# Altium project PainRegister.PrjPcb
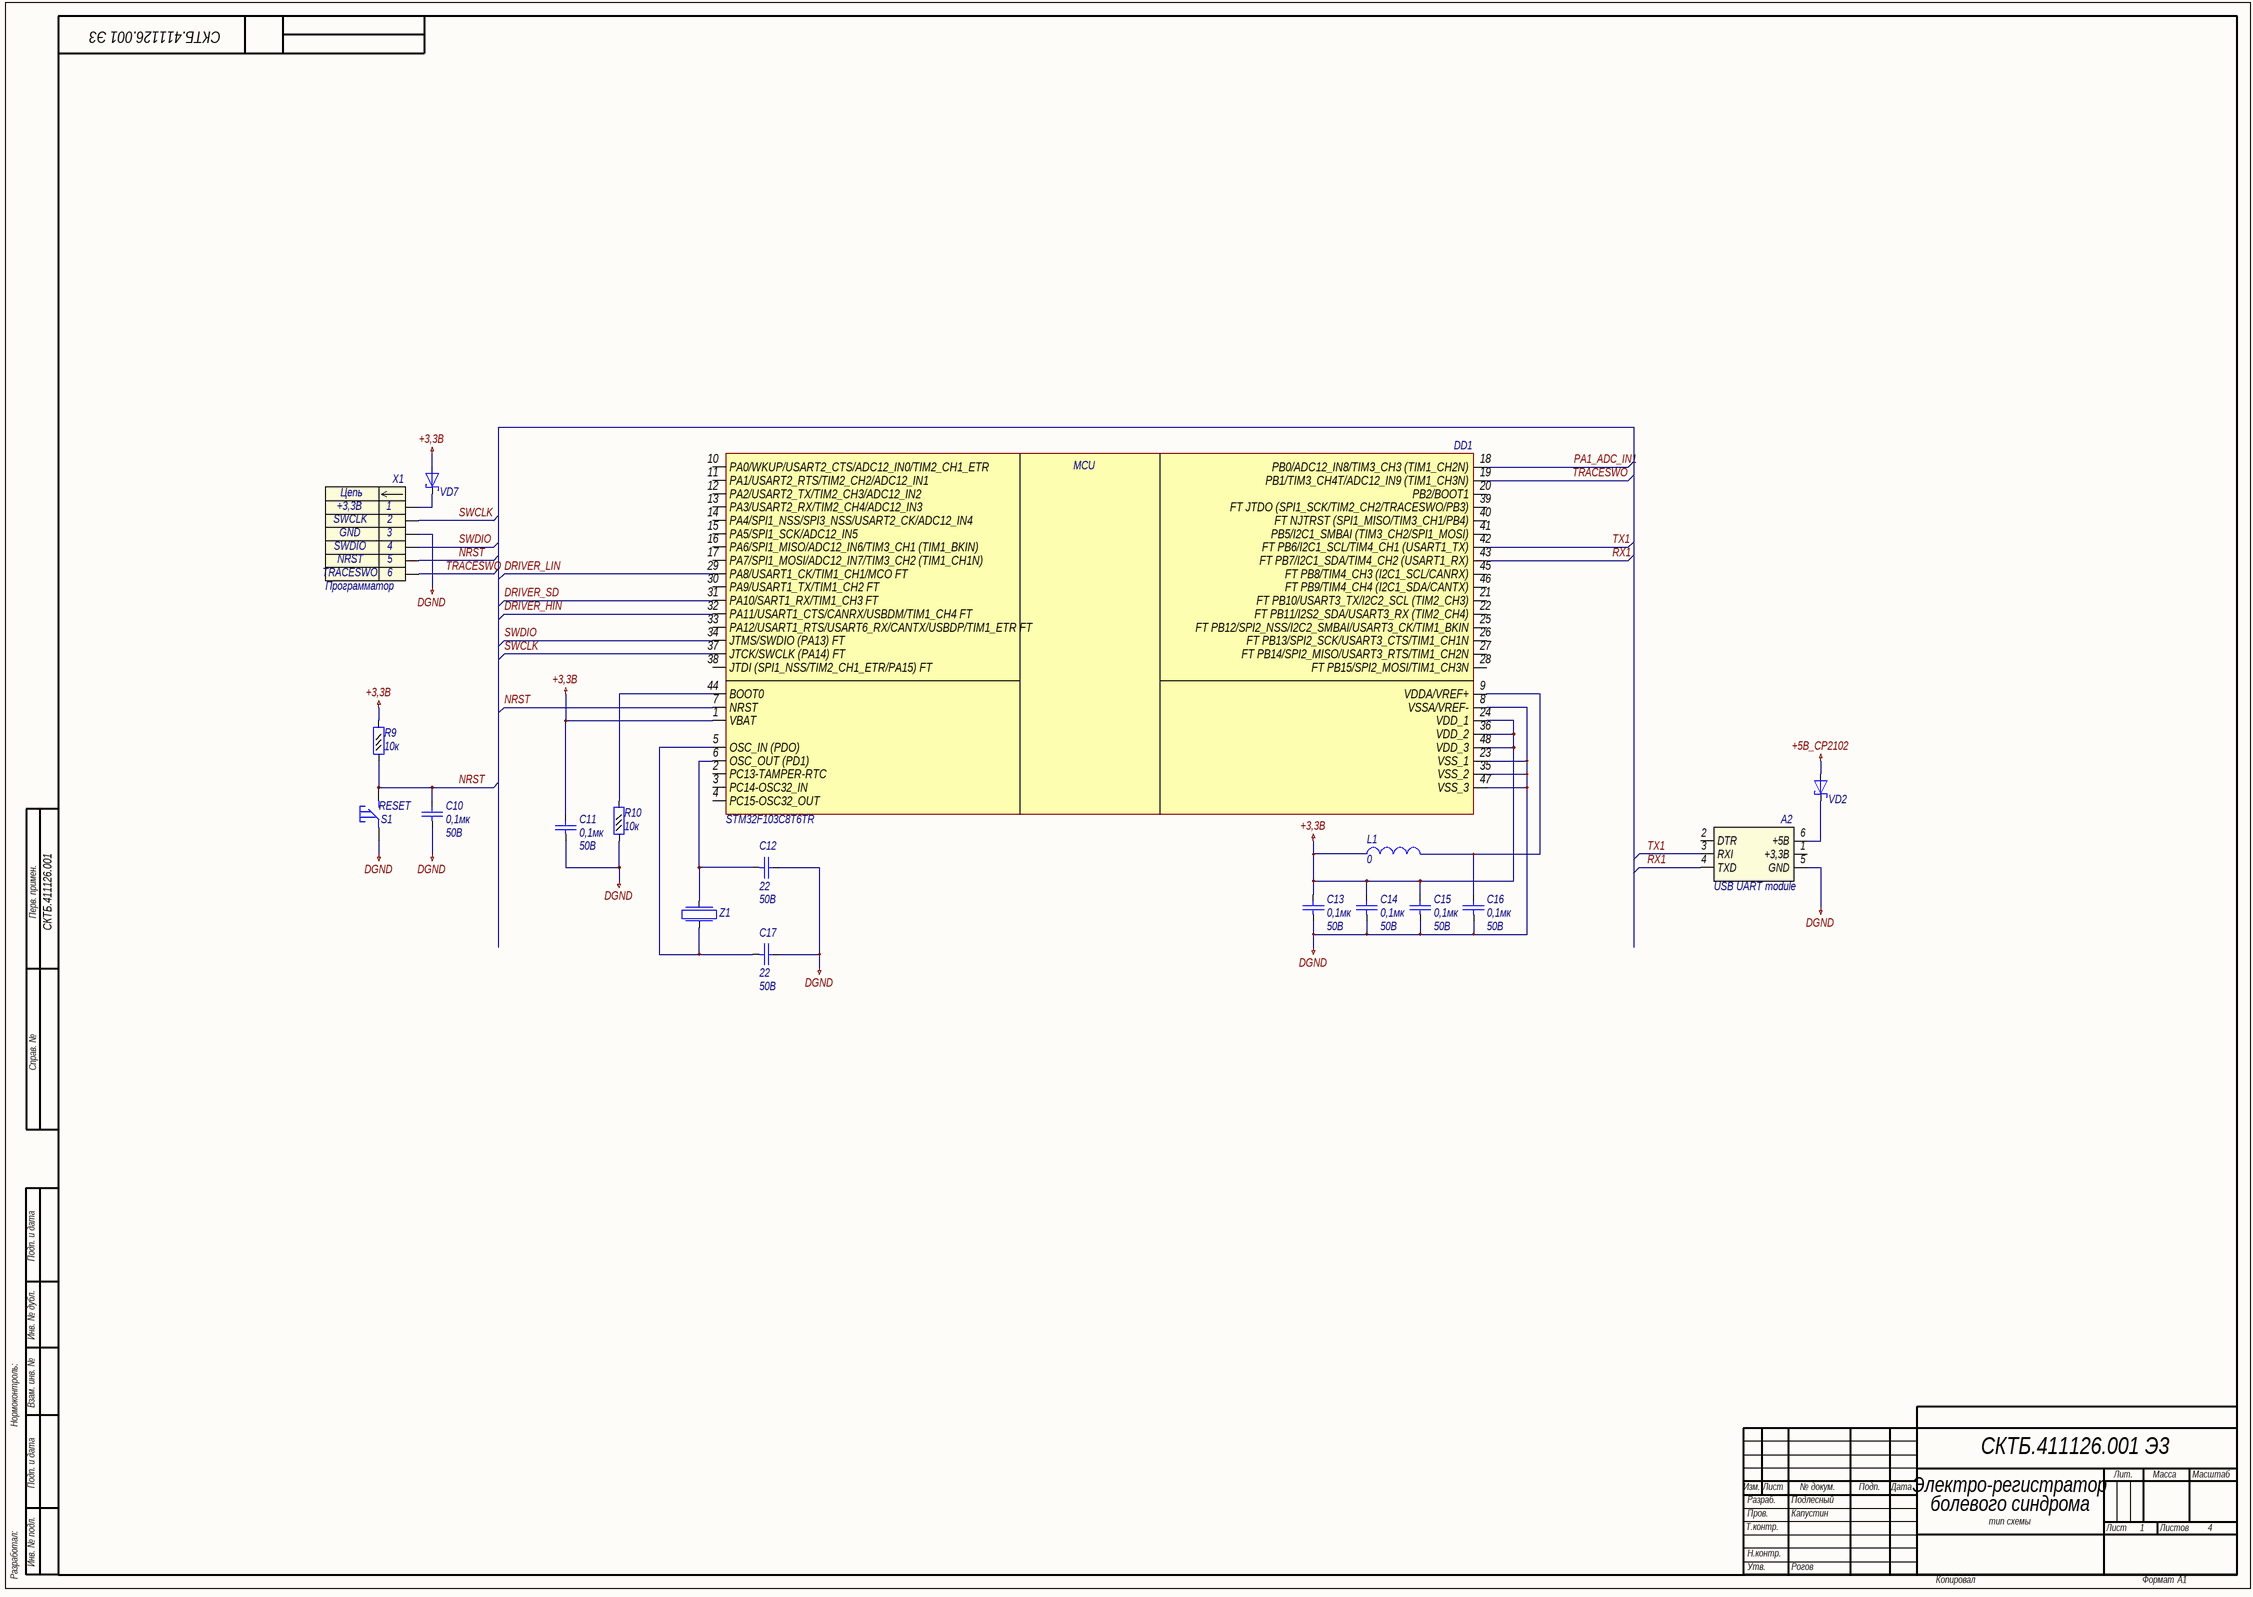
[diagram p0: PainRegister_MCU.SchDoc]
5 sheets, 103 parts. Net scope: global (net labels, ports and power ports of the same name join across sheets).
Board file: PainRegister.PcbDoc
Sheets:
  PainRegister_MCU.SchDoc
  PainRegister_Power.SchDoc
  PainRegister_PWM.SchDoc
  PainRegister_Bridge.SchDoc
  PainRegister_Amplifier.SchDoc

## Sheet PainRegister_MCU.SchDoc: Электро-регистратор
size 840 x 594 mm; ApprovedBy: Рогов; CheckedBy: Капустин; DrawnBy: Подлесный; DocumentNumber: СКТБ.411126.001 Э3; SheetNumber: 1; SheetTotal: 4; Title1str: болевого синдрома; DocumentType: тип схемы; Format: A1; ImagePath: СКТБ.411126.001

### Parts
A2  USB UART module  [USB UART CP2102]
C10  value 0,1мк  Voltage: 50B  [C0603]  (hidden comment: Capacitor)
C11  value 0,1мк  Voltage: 50B  [C0603]  (hidden comment: Capacitor)
C12  value 22  Voltage: 50B  [C0603]  (hidden comment: Capacitor)
C13  value 0,1мк  Voltage: 50B  [C0603]  (hidden comment: Capacitor)
C14  value 0,1мк  Voltage: 50B  [C0603]  (hidden comment: Capacitor)
C15  value 0,1мк  Voltage: 50B  [C0603]  (hidden comment: Capacitor)
C16  value 0,1мк  Voltage: 50B  [C0603]  (hidden comment: Capacitor)
C17  value 22  Voltage: 50B  [C0603]  (hidden comment: Capacitor)
DD1  STM32F103C8T6TR  [LQFP48]
L1  value 0  [L0603]  (hidden comment: Inductor)
R9  value 10к  [R0603]  (hidden comment: Resistor_0,062Вт)
R10  value 10к  [R0603]  (hidden comment: Resistor_0,062Вт)
S1  RESET  [Button_SMD]
VD2  DiodeSchottky  [SOD-523]  (value not drawn)
VD7  DiodeSchottky  [SOD-523]  (value not drawn)
X1  Программатор  [PLS-6]
Z1  Crystal  [QSMD5.0x3.2x1.0]  (value not drawn)

### Nets
+3,3В: C11.2 C13.2 C14.2 C15.2 DD1.1(VBAT) DD1.24(VDD_1) DD1.36(VDD_2) DD1.48(VDD_3) L1.1 R9.2 VD7.2(A)
+5B_CP2102: VD2.2(A)
DGND: A2.5(GND) C10.1 C11.1 C12.2 C13.1 C14.1 C15.1 C16.1 C17.2 DD1.8(VSSA/VREF-) DD1.23(VSS_1) DD1.35(VSS_2) DD1.47(VSS_3) R10.1 S1.1 X1.3
DRIVER_HIN: DD1.32(PA11/USART1_CTS/CANRX/USBDM/TIM1_CH4_FT)
DRIVER_LIN: DD1.29(PA8/USART1_CK/TIM1_CH1/MCO_FT)
DRIVER_SD: DD1.31(PA10/SART1_RX/TIM1_CH3_FT)
NRST: C10.2 DD1.7(NRST) R9.1 S1.4 X1.5
PA1_ADC_IN1: DD1.18(PB0/ADC12_IN8/TIM3_CH3_(TIM1_CH2N))
RX1: A2.4(TXD) DD1.43(FT_PB7/I2C1_SDA/TIM4_CH2_(USART1_RX))
SWCLK: DD1.37(JTCK/SWCLK_(PA14)_FT) X1.2
SWDIO: DD1.34(JTMS/SWDIO_(PA13)_FT) X1.4
TRACESWO: DD1.19(PB1/TIM3_CH4T/ADC12_IN9_(TIM1_CH3N)) X1.6
TX1: A2.3(RXI) DD1.42(FT_PB6/I2C1_SCL/TIM4_CH1_(USART1_TX))
NetA2_6: A2.6(+5B) VD2.1(K)
NetC12_1: C12.1 DD1.6(OSC_OUT_(PD1)) Z1.2
NetC16_2: C16.2 DD1.9(VDDA/VREF+) L1.2
NetC17_1: C17.1 DD1.5(OSC_IN_(PDO)) Z1.1
NetDD1_44: DD1.44(BOOT0) R10.2
NetVD7_1: VD7.1(K) X1.1

Not connected (* = marked no-connect by the designer): A2 1(+3,3B) 2(DTR); DD1 2(PC13-TAMPER-RTC) 3(PC14-OSC32_IN) 4(PC15-OSC32_OUT) 10(PA0/WKUP/USART2_CTS/ADC12_IN0/TIM2_CH1_ETR) 11(PA1/USART2_RTS/TIM2_CH2/ADC12_IN1) 12(PA2/USART2_TX/TIM2_CH3/ADC12_IN2) 13(PA3/USART2_RX/TIM2_CH4/ADC12_IN3) 14(PA4/SPI1_NSS/SPI3_NSS/USART2_CK/ADC12_IN4) 15(PA5/SPI1_SCK/ADC12_IN5) 16(PA6/SPI1_MISO/ADC12_IN6/TIM3_CH1_(TIM1_BKIN)) 17(PA7/SPI1_MOSI/ADC12_IN7/TIM3_CH2_(TIM1_CH1N)) 20(PB2/BOOT1) 21(FT_PB10/USART3_TX/I2C2_SCL_(TIM2_CH3)) 22(FT_PB11/I2S2_SDA/USART3_RX_(TIM2_CH4)) 25(FT_PB12/SPI2_NSS/I2C2_SMBAI/USART3_CK/TIM1_BKIN) 26(FT_PB13/SPI2_SCK/USART3_CTS/TIM1_CH1N) 27(FT_PB14/SPI2_MISO/USART3_RTS/TIM1_CH2N) 28(FT_PB15/SPI2_MOSI/TIM1_CH3N) 30(PA9/USART1_TX/TIM1_CH2_FT) 33(PA12/USART1_RTS/USART6_RX/CANTX/USBDP/TIM1_ETR_FT) 38(JTDI_(SPI1_NSS/TIM2_CH1_ETR/PA15)_FT) 39(FT_JTDO_(SPI1_SCK/TIM2_CH2/TRACESWO/PB3)) 40(FT_NJTRST_(SPI1_MISO/TIM3_CH1/PB4)) 41(PB5/I2C1_SMBAI_(TIM3_CH2/SPI1_MOSI)) 45(FT_PB8/TIM4_CH3_(I2C1_SCL/CANRX)) 46(FT_PB9/TIM4_CH4_(I2C1_SDA/CANTX))

### Notes on the sheet
- Перв. примен.
- Справ. №
- Подп. и дата
- Инв. № дубл.
- Нормоконтроль:
- Взам. инв. №
- Изм.
- Лист
- № докум.
- Подп.
- Дата
- Лит.
- Масса
- Масштаб
- Т.контр.
- Пров.
- Разраб.
- Листов
- Разработал:
- Инв. № подл.
- Н.контр.
- Утв.
- Копировал
- Формат
- (in symbol connect5) Цепь
- (in symbol microcont0) MСU

### Library data of the parts
A2 = module2: id: module2; Part Name: USB UART CP2102
C10 C11 C13-C16 = cap131: Конденсатор; Part Name: Ceramic; Manufacture: Murata; Part Number: GRM188R71H104KA93D; id: cap131; TKE: X7R
C12 C17 = cap77: Конденсатор; Part Name: Ceramic; Manufacture: Yageo; Part Number: CC0603JRNPO9BN220; id: cap77; TKE: NP0
DD1 = microcont0: Medium-density performance line ARM®-based 32-bit MCU with 64  or 128 KB Flash, USB, CAN, 7 timers, 2 ADCs, 9 com. interfaces; Part Name: Microcontroller; Frequency: 72MHz; ADC: 10x12b; Interface: can, i2c, irda, lin, spi, uart, usb; Flash: 64kb; Pin in: 37; Power Supply: 2.0-3.6 V; id: microcont0; Part Number: STM32F103C8T6TR
L1 = ind0: EMI Suppression Filter; Part Name: EMI Suppression Filters; Part Number: BLM18PG181SN1D; Rated Current: 1,5A; id: ind0; Resistance: 0,09Ohm
R9 R10 = res483: Резистор; Manufacture: Yageo; Part Number: RC0603FR-0710KL; id: res483; Accuracy: 0.01; Part Name: Resistor; Power: 0,062Вт
S1 = btn4: Кнопка; Part Name: Button 5mm; id: btn4
VD2 VD7 = diode12: Диод Шоттки; Part Number: PMEG2010AEB.115; Manufacture: NXP Semiconductor; Max Reverse Voltage: 20B; Forward Voltage: 0,62B; Forward Current: 1А; Breakdown Current: 600uA; Capacitance: 25pF; Number of Channels: 1; id: diode12; Part Name: Diode Schottky
X1 = connect5: Разъем - 6 конт. вилка; Part Number: DS1021-1*6SF112-B; Manufacture: Ningbo connfly electronic; Contact_1: +3,3В; Contact_2: SWCLK; Contact_3: GND; Contact_4: SWDIO; Contact_5: NRST; Contact_6: TRACESWO; Etch: 2,54mm; Part Name: PLS-6; id: connect5
Z1 = crystal0: Кварцевый резонатор; Manufacture: GEYER; Part Number: KX-9A; Frequence: 8MHz; id: crystal0

## Sheet PainRegister_Power.SchDoc
size 420 x 297 mm; DocumentNumber: СКТБ.411126.001 Э3; SheetNumber: 2; Format: A3
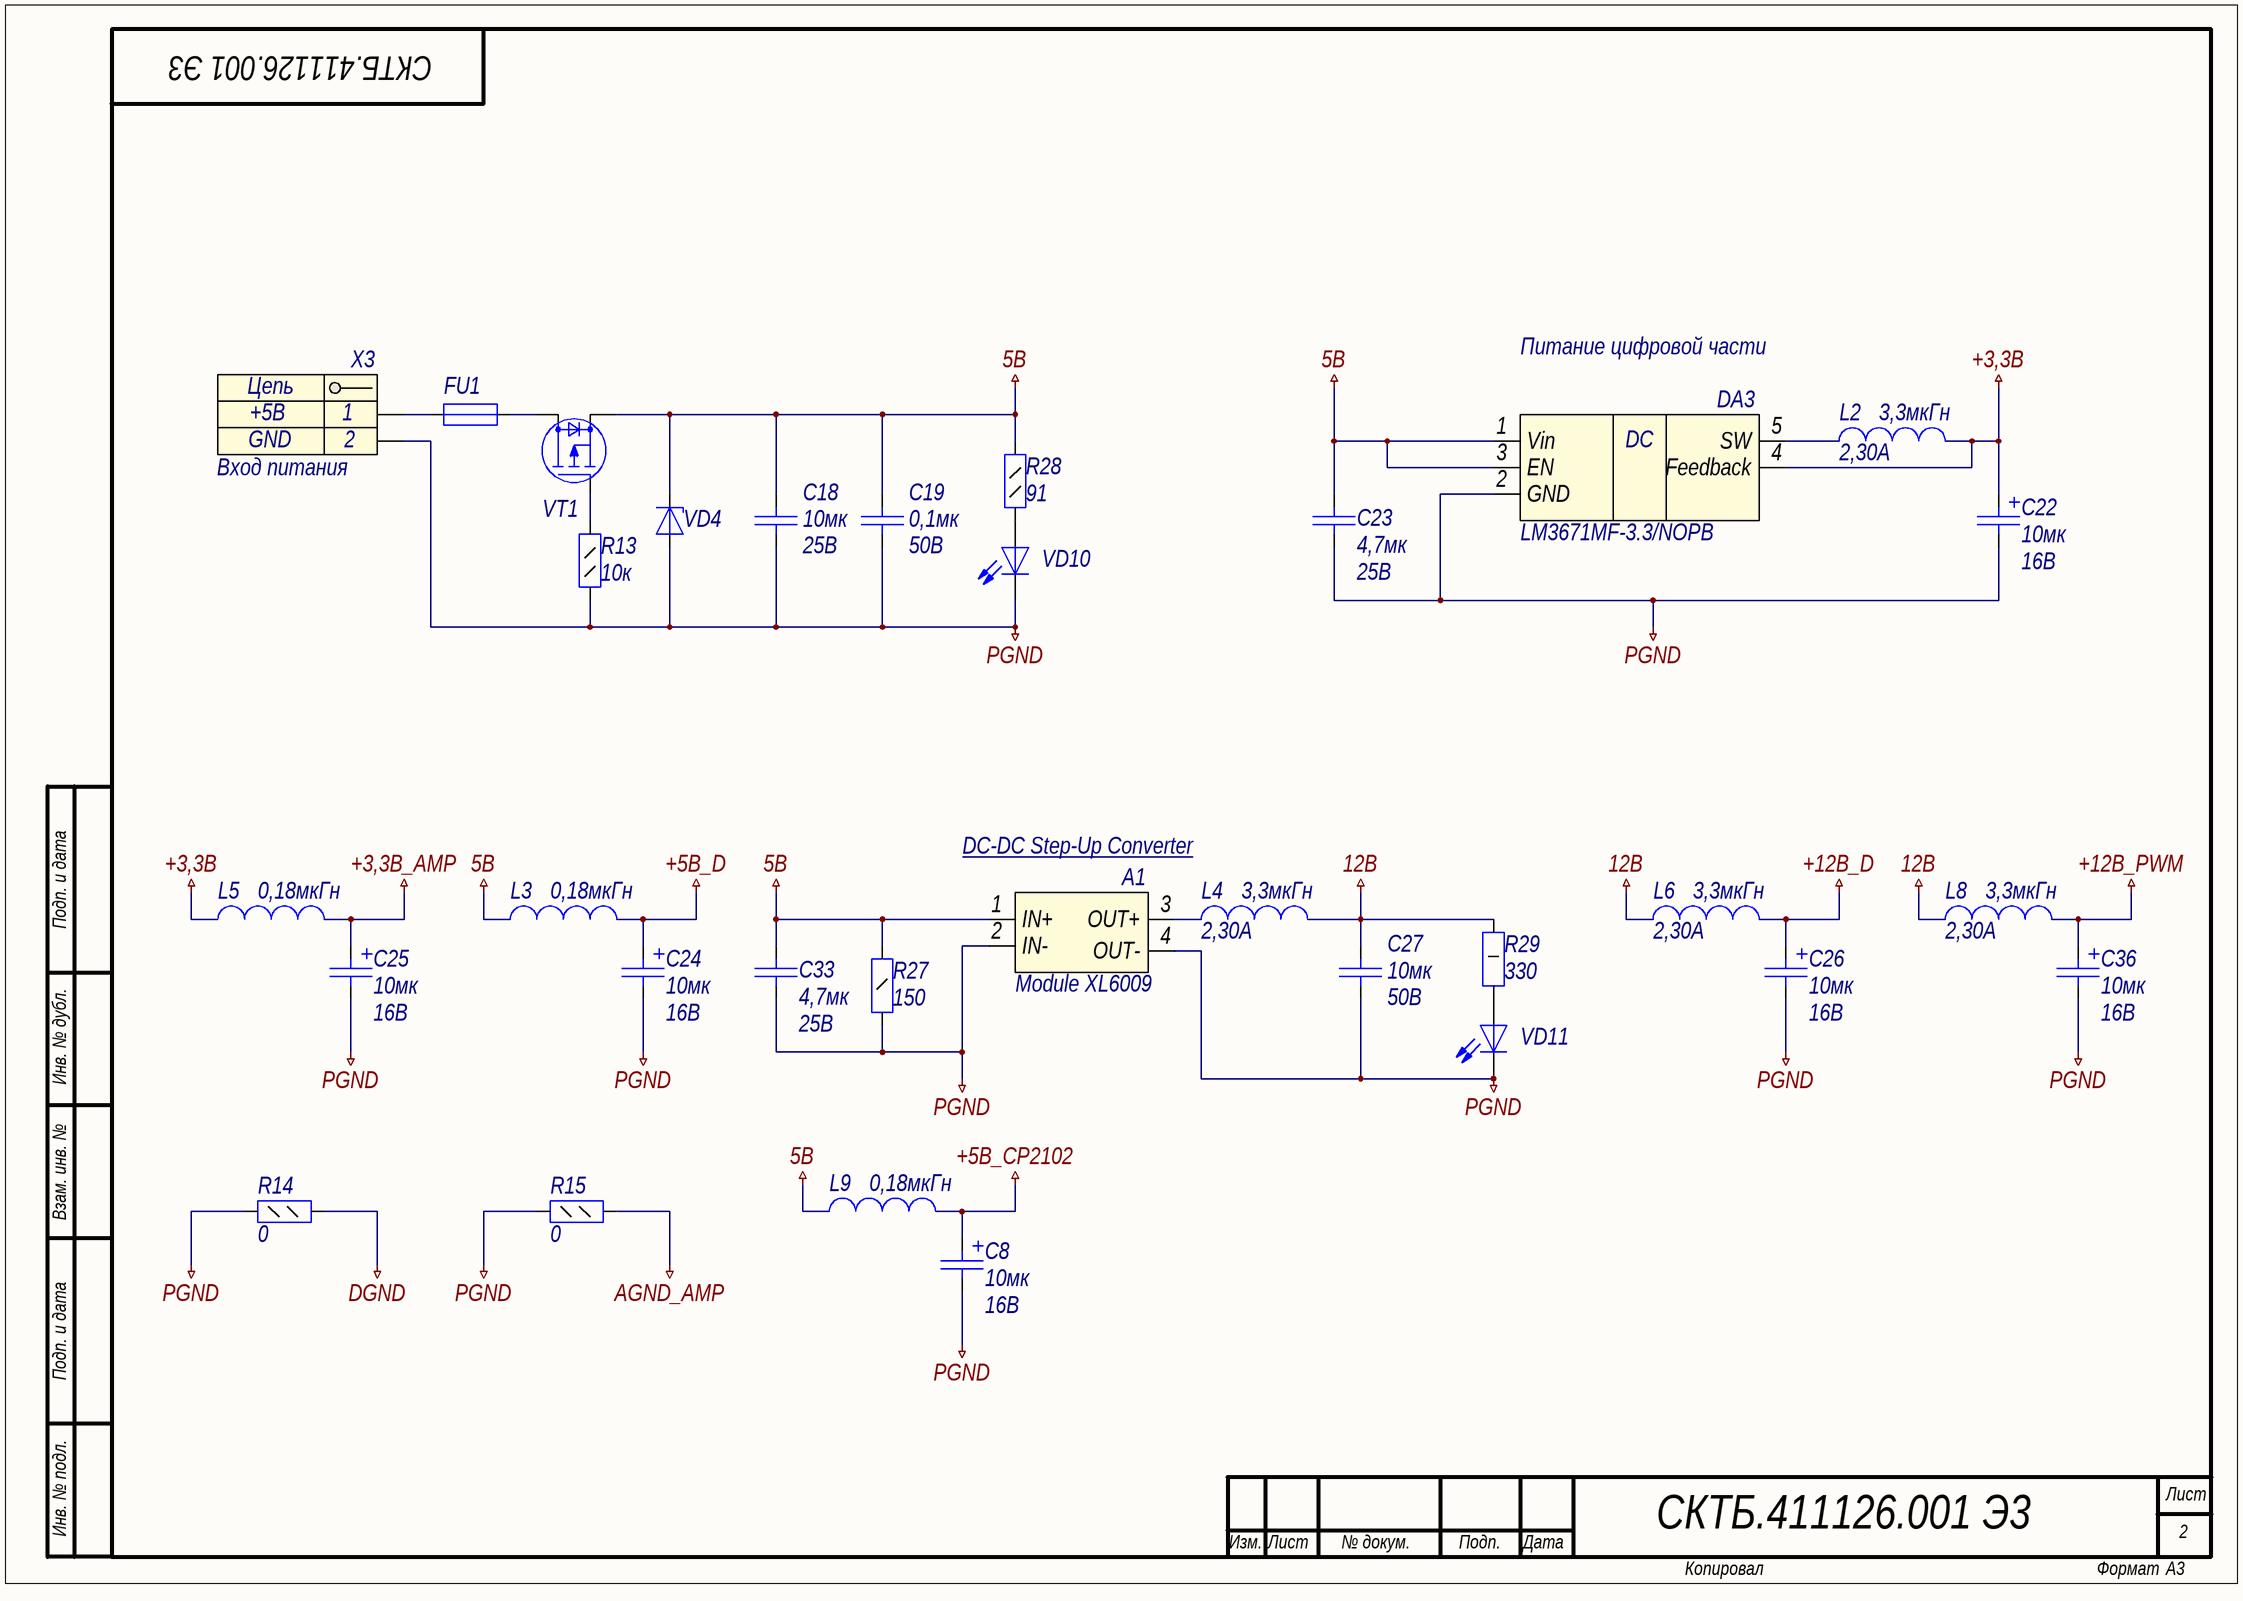
[diagram p1: PainRegister_Power.SchDoc]

### Parts
A1  Module XL6009  [Module XL6009]
C8  value 10мк  Voltage: 16В  [TANTAL CASE A]  (hidden comment: Capacitor_pol)
C18  value 10мк  Voltage: 25В  [C1206]  (hidden comment: Capacitor)
C19  value 0,1мк  Voltage: 50В  [C0805]  (hidden comment: Capacitor)
C22  value 10мк  Voltage: 16В  [TANTAL CASE A]  (hidden comment: Capacitor_pol)
C23  value 4,7мк  Voltage: 25B  [C0805]  (hidden comment: Capacitor)
C24  value 10мк  Voltage: 16В  [TANTAL CASE A]  (hidden comment: Capacitor_pol)
C25  value 10мк  Voltage: 16В  [TANTAL CASE A]  (hidden comment: Capacitor_pol)
C26  value 10мк  Voltage: 16В  [TANTAL CASE A]  (hidden comment: Capacitor_pol)
C27  value 10мк  Voltage: 50В  [C1210]  (hidden comment: Capacitor)
C33  value 4,7мк  Voltage: 25B  [C0805]  (hidden comment: Capacitor)
C36  value 10мк  Voltage: 16В  [TANTAL CASE A]  (hidden comment: Capacitor_pol)
DA3  Part Number: LM3671MF-3.3/NOPB  [SOT23-5]  (hidden comment: LM3671MF)
FU1  Fuse  [FUSE812]  (value not drawn)
L2  value 3,3мкГн  Rated Current: 2,30А  [SRR0604]  (hidden comment: Inductor)
L3  value 0,18мкГн  [L0805]  (hidden comment: Inductor)
L4  value 3,3мкГн  Rated Current: 2,30А  [SRR0604]  (hidden comment: Inductor)
L5  value 0,18мкГн  [L0805]  (hidden comment: Inductor)
L6  value 3,3мкГн  Rated Current: 2,30А  [SRR0604]  (hidden comment: Inductor)
L8  value 3,3мкГн  Rated Current: 2,30А  [SRR0604]  (hidden comment: Inductor)
L9  value 0,18мкГн  [L0805]  (hidden comment: Inductor)
R13  value 10к  [R0805]  (hidden comment: Resistor_0,125Вт)
R14  value 0  [R0805]  (hidden comment: Resistor_0,125Вт)
R15  value 0  [R0805]  (hidden comment: Resistor_0,125Вт)
R27  value 150  [R1206]  (hidden comment: Resistor_0,25Вт)
R28  value 91  [R0805]  (hidden comment: Resistor_0,125Вт)
R29  value 330  [R2512]  (hidden comment: Resistor_1Вт)
VD4  DiodeZener  [SMA]  (value not drawn)
VD10  LED  [L_0805]  (value not drawn)
VD11  LED  [L_0805]  (value not drawn)
VT1  P-MOSFET  [SOT23-3]  (value not drawn)
X3  Вход питания  [TERMINAL-2WAY-3.5MM]

### Nets
5B: A1.1(IN+) C18.2 C19.2 C23.2 C33.2 DA3.1(Vin) DA3.3(EN) L3.1 L9.1 R27.2 R28.2 VD4.1(K) VT1.3(S)
12В: C27.2 L4.2 L6.1 L8.1 R29.2
+3,3В: C22.1 DA3.4(Feedback) L2.2 L5.1
+3,3В_AMP: C25.1 L5.2
+5B_CP2102: C8.1 L9.2
+5B_D: C24.1 L3.2
+12В_D: C26.1 L6.2
+12В_PWM: C36.1 L8.2
AGND_AMP: R15.2
DGND: R14.2
PGND: A1.2(IN-) A1.4(OUT-) C8.2 C18.1 C19.1 C22.2 C23.1 C24.2 C25.2 C26.2 C27.1 C33.1 C36.2 DA3.2(GND) R13.1 R14.1 R15.1 R27.1 VD4.2(A) VD10.1(K) VD11.1(K) X3.2  [project net AMPLIFIER-]
NetA1_3: A1.3(OUT+) L4.1
NetDA3_5: DA3.5(SW) L2.1
NetFU1_1: FU1.1 X3.1
NetFU1_2: FU1.2 VT1.2(D)
NetR13_2: R13.2 VT1.1(G)
NetR28_1: R28.1 VD10.2(A)
NetR29_1: R29.1 VD11.2(A)

### Notes on the sheet
- Питание цифровой части
- DC-DC Step-Up Converter
- Подп. и дата
- Инв. № дубл.
- Взам. инв. №
- Инв. № подл.
- Лист
- Изм.
- № докум.
- Подп.
- Дата
- Копировал
- Формат
- (in symbol connect34) Цепь
- (in symbol pwr2) DC

### Library data of the parts
A1 = module4: DC-DC step-up converter for 5/32-V to 5/35-V; Part Name: XL6009E1; id: module4
C8 C22 C24-C26 C36 = cap199: Конденсатор полярный; Part Name: Tantal; Manufacture: Vishay; Part Number: 293D106X9016A2TE3; id: cap199
C18 = cap186: Конденсатор; Part Name: Ceramic; Manufacture: Murata; Part Number: GRM31CR71E106KA12L*; id: cap186; TKE: X7R
C19 = cap160: Конденсатор; Part Name: Ceramic; Manufacture: Murata; Part Number: GRM21BR71H104KA01L; id: cap160; TKE: X7R
C23 C33 = cap153: Конденсатор; Part Name: Ceramic; Manufacture: Murata; Part Number: GRM21BR61E475KA12L; id: cap153; TKE: X5R
C27 = cap205: Конденсатор; Part Name: Ceramic; Manufacture: Murata; Part Number: GRM32ER71H106K; id: cap205; TKE: X7R
DA3 = pwr2: Step-Down DC-DC Converter; Part Name: 600-mA Step-Down DC-DC Converter; Manufacturer: Texas Instruments; id: pwr2; Input Voltage: 2,7 - 5,5B; Output Voltage: 3,3B; Current: 0,6A; Type: Impulse
FU1 = fuse15: Предохранитель; Part Name: Resettable Fuses; Manufacture: Bourns; Part Number: MF-MSMF260; id: fuse15; V max: 6B; I max: 100A; I hold: 2,6A; I trip: 5,2A; Resistance: 0,015Ohms
L2 L4 L6 L8 = ind138: EMI Suppression Filter; Part Name: SMD Power Inductors; Part Number: SRR0604-3R3ML; Manufacture: Bourns; id: ind138; Saturation Current: 2,90А; Resistance: 0,050Ohm
L3 L5 L9 = ind2: EMI Suppression Filter; Part Number: CM201212-R18KL; Rated Current: 120-540мА; id: ind2; Part Name: Inductor
R13 = res97: Резистор; Manufacture: Yageo; Part Number: RC0805FR-0710KL; id: res97; Accuracy: 0.01; Part Name: Resistor; Power: 0,125Вт
R14 R15 = res0: Резистор; Manufacture: Yageo; Part Number: RC0805FR-070RL; id: res0; Accuracy: 0.01; Part Name: Resistor; Power: 0,125Вт
R27 = res632: Резистор; Manufacture: Yageo; Part Number: RC1206FR-07150RL; id: res632; Accuracy: 0.01; Power: 0,25Вт; Part Name: Resistor
R28 = res48: Резистор; Manufacture: Yageo; Part Number: RC0805FR-0791RL; id: res48; Accuracy: 0.01; Part Name: Resistor; Power: 0,125Вт
R29 = res833: Резистор; Manufacture: Yageo; Part Number: RC2512FR-07330RL; id: res833; Accuracy: 0.01; Power: 1Вт; Part Name: Resistor
VD4 = SMAJ5.0A: Cтабилитрон (лавинный выпрямительный диод) односторонний; Part Name: TVS diode Unidirectional; Manufacture: ST Microelectronics; id: tvs123; Leakage Current: 20uA; Stand-off Voltage: 5B; Breakdown Voltage: 6,74B; Clamping voltage: 9,2B; Dynamic resistance: 0,049Ohm; Peak Pulse Power: 400W; Number of diodes: 1; Part Number: SMAJ5.0A
VD10 VD11 = diode5: Светодиод; Part Number: KP-2012EC; id: diode5; Part Name: LED
VT1 = trans11: N-MOSFET; Part Number: IRLML6401TRPBF; Manufacturer: International Rectifier; Structure: p-channel; V drain-source max: (-12B); Rds: 0,05Ohm; Gate-to-source voltage: (+-)8B; Continuous drain current: 4,3A; Pulsed drain current: 34A; Power dissipation: 1,3W; id: trans11
X3 = connect34: Разъем - 2 конт. клеммник; Part Name: TERMINAL BLOCK 2 way; Contact_1: +5В; Contact_2: GND; Etch: 3.5mm; id: connect34

## Sheet PainRegister_PWM.SchDoc
size 420 x 297 mm; DocumentNumber: СКТБ.411126.001 Э3; SheetNumber: 3; Format: A3
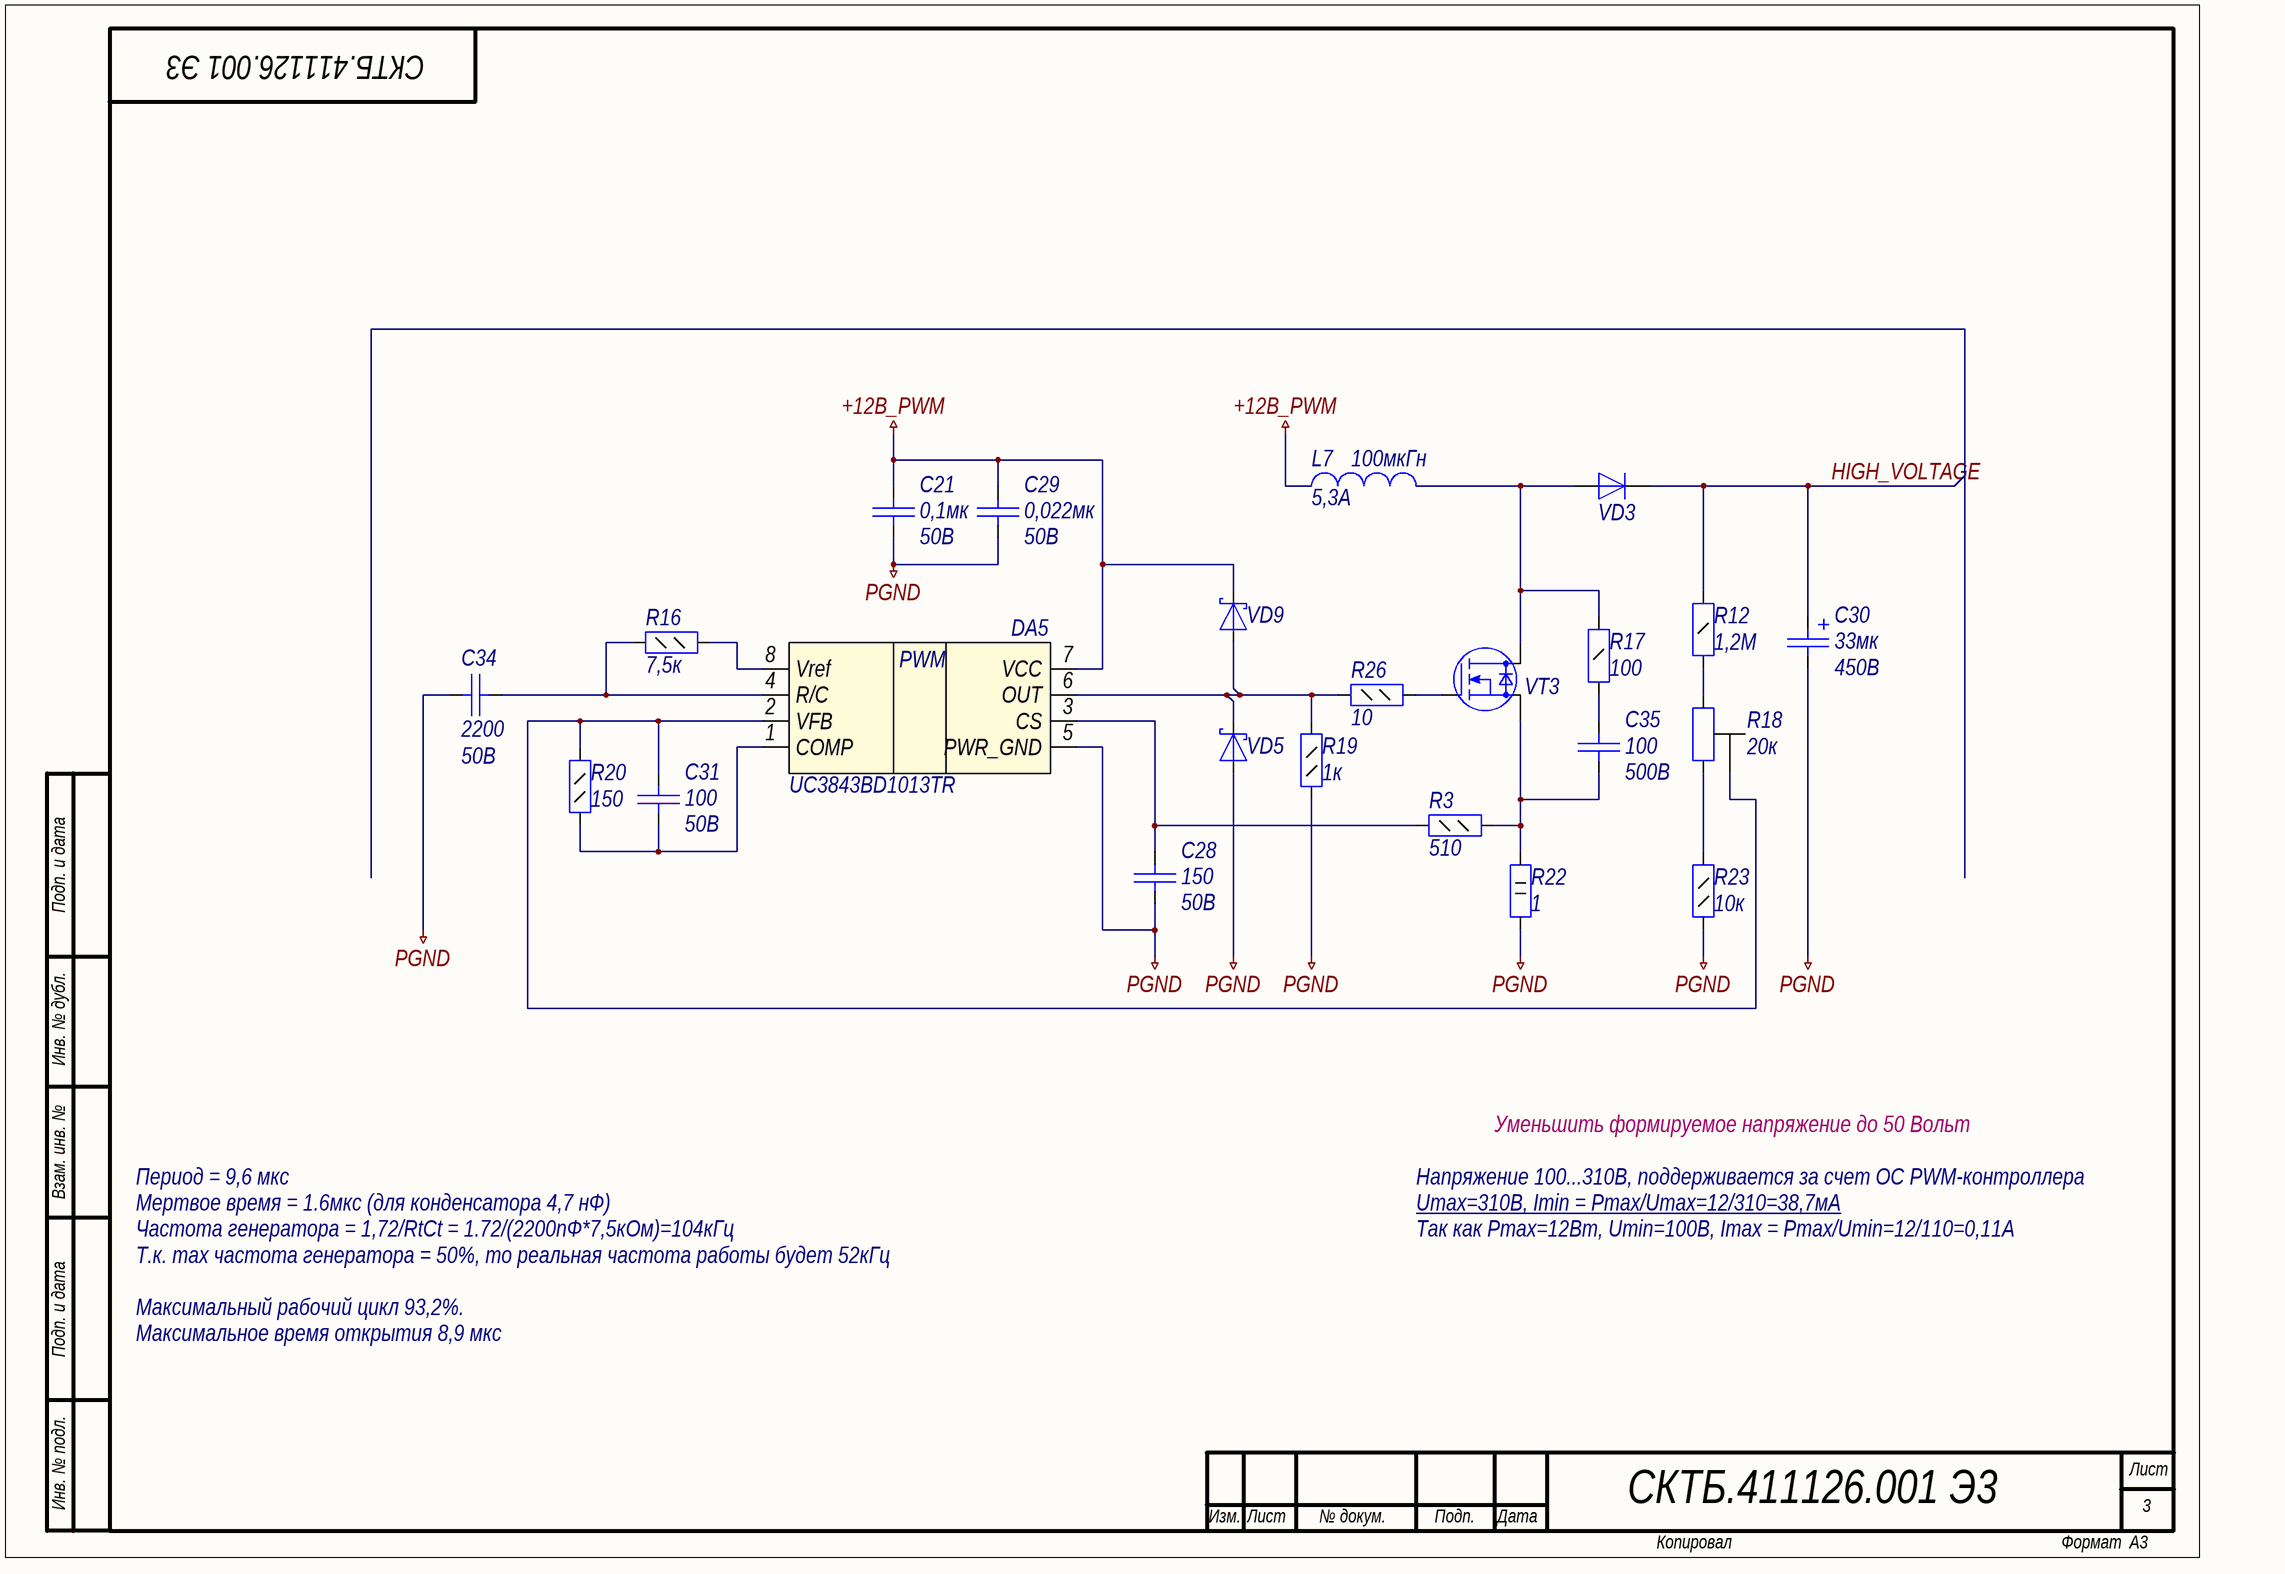
[diagram p2: PainRegister_PWM.SchDoc]

### Parts
C21  value 0,1мк  Voltage: 50В  [C0805]  (hidden comment: Capacitor)
C28  value 150  Voltage: 50B  [C0603]  (hidden comment: Capacitor)
C29  value 0,022мк  Voltage: 50В  [C1206]  (hidden comment: Capacitor)
C30  value 33мк  Voltage: 450В  [K50-35(16X32)]  (hidden comment: Capacitor_pol)
C31  value 100  Voltage: 50B  [C0603]  (hidden comment: Capacitor)
C34  value 2200  Voltage: 50В  [C0805]  (hidden comment: Capacitor)
C35  value 100  Voltage: 500В  [C1206]  (hidden comment: Capacitor)
DA5  Part Number: UC3843BD1013TR  [SO8]  (hidden comment: UC384X)
L7  value 100мкГн  Rated Current: 5,3A  [SRP1770TA]  (hidden comment: Inductor)
R3  value 510  [R1206]  (hidden comment: Resistor_0,25Вт)
R12  value 1,2М  [R1206]  (hidden comment: Resistor_0,25Вт)
R16  value 7,5к  [R0805]  (hidden comment: Resistor_0,125Вт)
R17  value 100  [R1206]  (hidden comment: Resistor_0,25Вт)
R18  value 20к  [3296Y]  (hidden comment: Potentiometer)
R19  value 1к  [R0805]  (hidden comment: Resistor_0,125Вт)
R20  value 150  [R0805]  (hidden comment: Resistor_0,125Вт)
R22  1  [KNP-2]
R23  value 10к  [R0805]  (hidden comment: Resistor_0,125Вт)
R26  value 10  [R0805]  (hidden comment: Resistor_0,125Вт)
VD3  Diode  [SMA]  (value not drawn)
VD5  DiodeSchottky  [SOD-123]  (value not drawn)
VD9  DiodeSchottky  [SOD-123]  (value not drawn)
VT3  N-MOSFET  [D2PAK]  (value not drawn)

### Nets
+12В_PWM: C21.2 C29.2 DA5.7(VCC) L7.1 VD9.1(K)
PGND: C21.1 C28.1 C29.1 C30.2 C34.1 DA5.5(PWR_GND) R19.1 R22.1 R23.1 VD5.2(A)  [project net AMPLIFIER-]
HIGH_VOLTAGE: C30.1 R12.2 VD3.1(K)
NetC28_2: C28.2 DA5.3(CS) R3.1
NetC31_1: C31.1 DA5.1(COMP) R20.1
NetC31_2: C31.2 DA5.2(VFB) R18.2 R20.2
NetC34_2: C34.2 DA5.4(R/C) R16.1
NetC35_1: C35.1 R3.2 R22.2 VT3.3(S)
NetC35_2: C35.2 R17.1
NetDA5_6: DA5.6(OUT) R19.2 R26.1 VD5.1(K) VD9.2(A)
NetDA5_8: DA5.8(Vref) R16.2
NetL7_2: L7.2 R17.2 VD3.2(A) VT3.2(D)
NetR12_1: R12.1 R18.1
NetR18_3: R18.3 R23.2
NetR26_2: R26.2 VT3.1(G)

### Notes on the sheet
- Подп. и дата
- Инв. № дубл.
- Взам. инв. №
- Период = 9,6 мкс
- Напряжение 100...310В, поддерживается за счет ОС PWM-контроллера
- Уменьшить формируемое напряжение до 50 Вольт
- Частота генератора = 1,72/RtCt = 1.72/(2200пФ*7,5кОм)=104кГц
- Мертвое время = 1.6мкс (для конденсатора 4,7 нФ)
- Так как Pmax=12Вт, Umin=100В, Imax = Pmax/Umin=12/110=0,11А
- Umax=310В, Imin = Pmax/Umax=12/310=38,7мА
- Т.к. max частота генератора = 50%, то реальная частота работы будет 52кГц
- Максимальный рабочий цикл 93,2%.
- Максимальное время открытия 8,9 мкс
- Инв. № подл.
- Лист
- Изм.
- № докум.
- Подп.
- Дата
- Копировал
- Формат
- (in symbol driver22) PWM

### Library data of the parts
C21 = cap160: as C19 on sheet PainRegister_Power
C28 = cap93: Конденсатор; Part Name: Ceramic; Manufacture: Murata; Part Number: GRM1885C1H151J; id: cap93; TKE: NP0
C29 = cap175: Конденсатор; Part Name: Ceramic; Manufacture: Murata; Part Number: GRM319R71H223K; id: cap175; TKE: X7R
C30 = cap257: Конденсатор полярный; Part Name: Electrolit; Manufacture: Тайвань; Part Number: ECAP33uF/450V; id: cap257; tga: 0.20%
C31 = cap91: Конденсатор; Part Name: Ceramic; Manufacture: Murata; Part Number: GRM1885C1H101J; id: cap91; TKE: NP0
C34 = cap168: Конденсатор; Part Name: Ceramic; Manufacture: Murata; Part Number: GRM216R71H222K; id: cap168; TKE: X7R
C35 = cap260: Конденсатор; Part Name: Ceramic; Manufacture: Yageo; Part Number: CC1206JRNPOBBN101; id: cap260; TKE: NP0
DA5 = driver22: Current Mode PWM  Controller for Forward and  Flyback Applications; Manufacture: ST Microelectronics; Min Operating Supply Voltage: 7,8B; Max Operating Supply Voltage: 9B; Duty Cycle max: 1; id: driver22; Part Name: PWM Controller for Forward and Flyback Applications
L7 = ind134: EMI Suppression Filter; Part Name: SMD Power Inductors; Part Number: SRP1770TA-101M; Manufacture: Bourns; id: ind134; Saturation Current: 6,5A; Resistance: 0,118Ohm; q-factor: 20
R3 = res66: Резистор; Manufacture: Yageo; Part Number: RC0805FR-07510RL; id: res66; Accuracy: 0.01; Power: 0,125Вт; Part Name: Resistor
R12 = res726: Резистор; Manufacture: Yageo; Part Number: RC1206FR-071M2; id: res726; Accuracy: 0.01; Power: 0,25Вт; Part Name: Resistor
R16 = res94: Резистор; Manufacture: Yageo; Part Number: RC0805FR-077K5; id: res94; Accuracy: 0.01; Part Name: Resistor; Power: 0,125Вт
R17 = res628: Резистор; Manufacture: Yageo; Part Number: RC1206FR-07100RL; id: res628; Accuracy: 0.01; Power: 0,25Вт; Part Name: Resistor
R18 = res987: Part Name: Resistor; Manufacture: Bourns; Part Number: 3296Y-1-203LF; id: res987; Accuracy: 0.1; Power: 0,5Вт
R19 = res73: Резистор; Manufacture: Yageo; Part Number: RC0805FR-071KL; id: res73; Accuracy: 0.01; Part Name: Resistor; Power: 0,125Вт
R20 = res53: Резистор; Manufacture: Yageo; Part Number: RC0805FR-07150RL; id: res53; Accuracy: 0.01; Part Name: Resistor; Power: 0,125Вт
R22 = res988: Резистор; Part Name: Resistor; Manufacture: Тайвань; Part Number: KNP-2W-1KJ; id: res988; Accuracy: 0.05; Power: 2Вт; Value: 1
R23 = res97: as R13 on sheet PainRegister_Power; Part Name: Resistor; Power: 0,125Вт
R26 = res25: Резистор; Manufacture: Yageo; Part Number: RC0805FR-0710RL; id: res25; Accuracy: 0.01; Part Name: Resistor; Power: 0,125Вт
VD3 = diode0: Диод; Part Number: GS1M; id: diode0; Max Reverse Voltage: 1000B; Forward Voltage: 1,1B; Forward Current: 1A; Part Name: Diode
VD5 VD9 = diode16: Диод Шоттки; Part Number: MBR0520LT1; Manufacture: ON Semiconductor; Max Reverse Voltage: 20B; Forward Voltage: 0,385B; Forward Current: 0,5А; Breakdown Current: 5,5А; Capacitance: 10pF; Number of Channels: 1; id: diode16; Part Name: Diode Schottky
VT3 = trans10: Part Number: IRF840ASPBF; Manufacturer: Vishay; Structure: n-channel; V drain-source max: 500B; Rds: 0,85Ohm; Gate-to-source voltage: (+-)30B; Continuous drain current: 8A; Pulsed drain current: 32A; Power dissipation: 125W; id: trans10

## Sheet PainRegister_Bridge.SchDoc
size 420 x 297 mm; DocumentNumber: СКТБ.411126.001 Э3; SheetNumber: 4; Format: A3
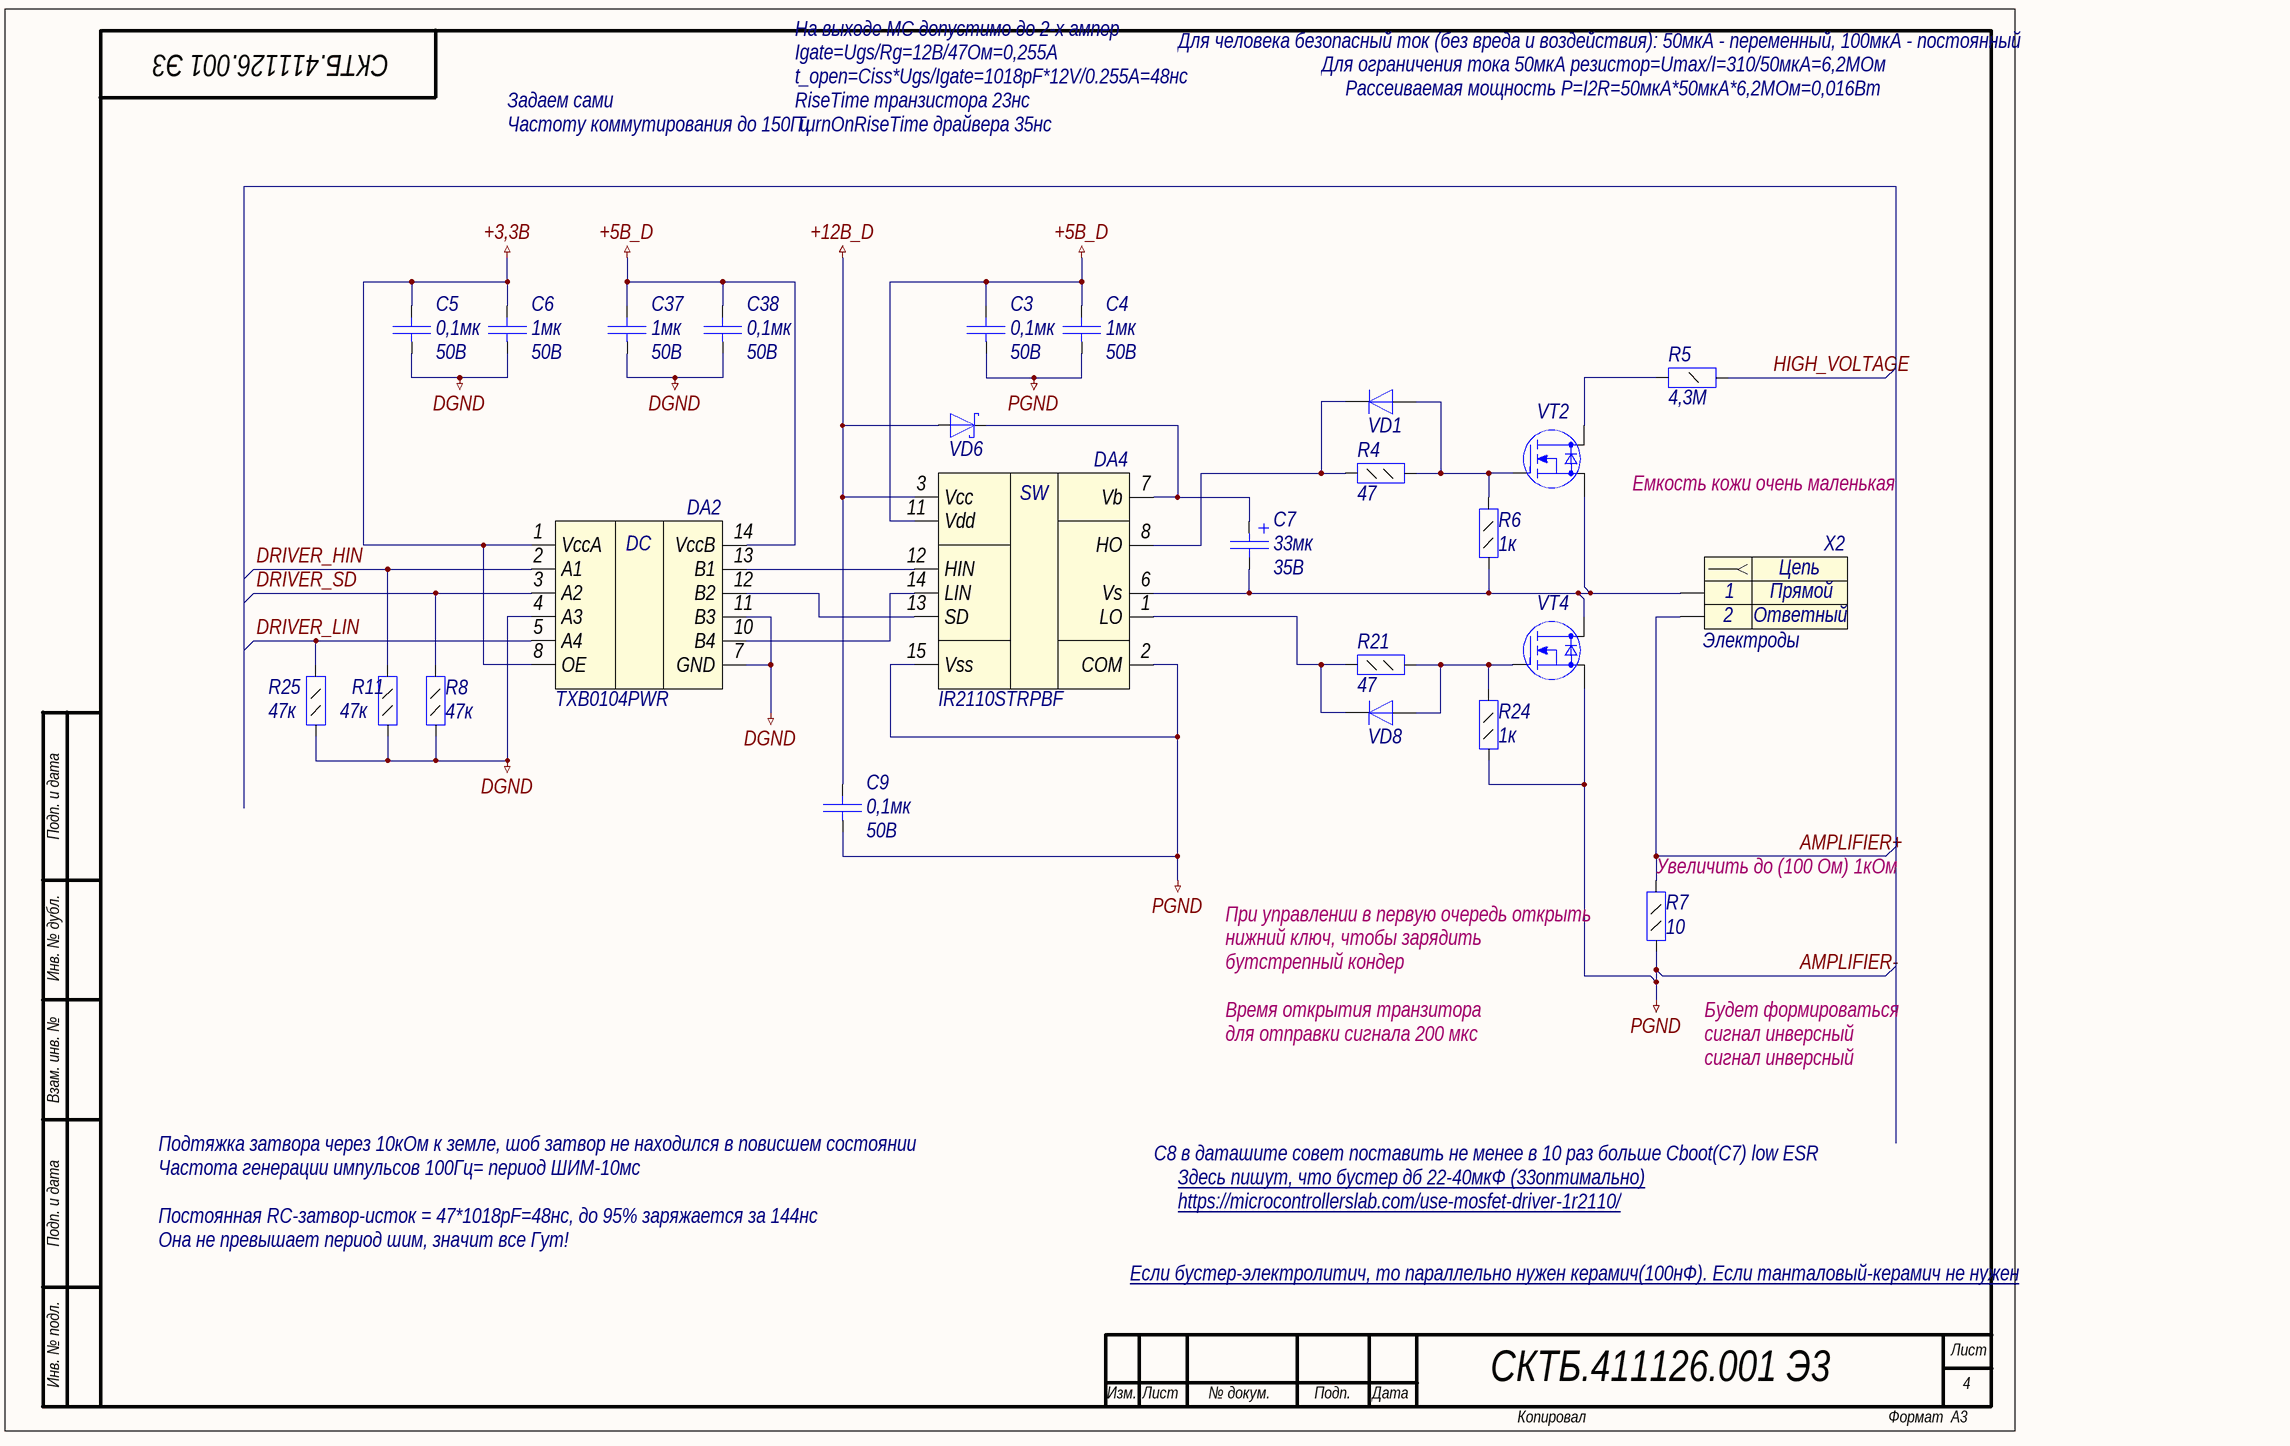
[diagram p3: PainRegister_Bridge.SchDoc]

### Parts
C3  value 0,1мк  Voltage: 50В  [C0805]  (hidden comment: Capacitor)
C4  value 1мк  Voltage: 50B  [C0805]  (hidden comment: Capacitor)
C5  value 0,1мк  Voltage: 50В  [C0805]  (hidden comment: Capacitor)
C6  value 1мк  Voltage: 50B  [C0805]  (hidden comment: Capacitor)
C7  value 33мк  Voltage: 35В  [TANTAL CASE D]  (hidden comment: Capacitor_pol)
C9  value 0,1мк  Voltage: 50В  [C0805]  (hidden comment: Capacitor)
C37  value 1мк  Voltage: 50B  [C0805]  (hidden comment: Capacitor)
C38  value 0,1мк  Voltage: 50В  [C0805]  (hidden comment: Capacitor)
DA2  Part Number: TXB0104PWR  [TSSOP14]  (hidden comment: TXB0104)
DA4  Part Number: IR2110STRPBF  [SO16]  (hidden comment: IR2110S)
R4  value 47  [R0805]  (hidden comment: Resistor_0,125Вт)
R5  value 4,3М  [R1206]  (hidden comment: Resistor_0,25Вт)
R6  value 1к  [R0805]  (hidden comment: Resistor_0,125Вт)
R7  value 10  [R0805]  (hidden comment: Resistor_0,125Вт)
R8  value 47к  [R0805]  (hidden comment: Resistor_0,125Вт)
R11  value 47к  [R0805]  (hidden comment: Resistor_0,125Вт)
R21  value 47  [R0805]  (hidden comment: Resistor_0,125Вт)
R24  value 1к  [R0805]  (hidden comment: Resistor_0,125Вт)
R25  value 47к  [R0805]  (hidden comment: Resistor_0,125Вт)
VD1  Diode  [SMA]  (value not drawn)
VD6  DiodeSchottky  [SMA]  (value not drawn)
VD8  Diode  [SMA]  (value not drawn)
VT2  N-MOSFET  [D2PAK]  (value not drawn)
VT4  N-MOSFET  [D2PAK]  (value not drawn)
X2  Электроды  [CWF-2R]

### Nets
+3,3В: C5.2 C6.2 DA2.1(VccA) DA2.8(OE)
+5B_D: C3.2 C4.2 C37.2 C38.2 DA2.14(VccB) DA4.11(Vdd)
+12В_D: C9.2 DA4.3(Vcc) VD6.2(A)
AMPLIFIER-: C3.1 C4.1 C9.1 DA4.2(COM) DA4.15(Vss) R7.1 R24.1 VT4.3(S)  [also labelled PGND]
DGND: C5.1 C6.1 C37.1 C38.1 DA2.4(A3) DA2.7(GND) DA2.11(B3) R8.1 R11.1 R25.1
AMPLIFIER+: R7.2 X2.2
DRIVER_HIN: DA2.2(A1) R11.2
DRIVER_LIN: DA2.5(A4) R25.2
DRIVER_SD: DA2.3(A2) R8.2
HIGH_VOLTAGE: R5.2
NetC7_1: C7.1 DA4.7(Vb) VD6.1(K)
NetC7_2: C7.2 DA4.6(Vs) R6.1 VT2.3(S) VT4.2(D) X2.1
NetDA2_10: DA2.10(B4) DA4.14(LIN)
NetDA2_12: DA2.12(B2) DA4.13(SD)
NetDA2_13: DA2.13(B1) DA4.12(HIN)
NetDA4_1: DA4.1(LO) R21.1 VD8.1(K)
NetDA4_8: DA4.8(HO) R4.1 VD1.1(K)
NetR4_2: R4.2 R6.2 VD1.2(A) VT2.1(G)
NetR5_1: R5.1 VT2.2(D)
NetR21_2: R21.2 R24.2 VD8.2(A) VT4.1(G)

### Notes on the sheet
- На выходе МС допустимо до 2-х ампер
- Для человека безопасный ток (без вреда и воздействия): 50мкА - переменный, 100мкА - постоянный
- Задаем сами
- Igate=Ugs/Rg=12В/47Ом=0,255А
- t_open=Ciss*Ugs/Igate=1018pF*12V/0.255A=48нс
- RiseTime транзистора 23нс
- Для ограничения тока 50мкА резистор=Umax/I=310/50мкA=6,2МОм
- Рассеиваемая мощность P=I2R=50мкA*50мкA*6,2МОм=0,016Вт
- Частоту коммутирования до 150Гц
- TurnOnRiseTime драйвера 35нс
- (near VT2) Емкость кожи очень маленькая
- Подп. и дата
- (near R7) Увеличить до (100 Ом) 1кОм
- Инв. № дубл.
- (near R7) При управлении в первую очередь открыть
- нижний ключ, чтобы зарядить
- бутстрепный кондер
- Время открытия транзитора
- Будет формироваться
- Взам. инв. №
- для отправки сигнала 200 мкс
- сигнал инверсный
- Подтяжка затвора через 10кОм к земле, шоб затвор не находился в повисшем состоянии
- Частота генерации импульсов 100Гц= период ШИМ-10мс
- C8 в даташите совет поставить не менее в 10 раз больше Cboot(C7) low ESR
- https://microcontrollerslab.com/use-mosfet-driver-1r2110/
- Здесь пишут, что бустер дб 22-40мкФ (33оптимально)
- Постоянная RC-затвор-исток = 47*1018pF=48нс, до 95% заряжается за 144нс
- Она не превышает период шим, значит все Гут!
- Если бустер-электролитич, то параллельно нужен керамич(100нФ). Если танталовый-керамич не нужен
- Инв. № подл.
- Лист
- Изм.
- № докум.
- Подп.
- Дата
- Копировал
- Формат
- (in symbol connect7) Цепь
- (in symbol driver23) SW
- (in symbol pwr48) DC

### Library data of the parts
C3 C5 C9 C38 = cap160: as C19 on sheet PainRegister_Power
C4 C6 C37 = cap151: Конденсатор; Part Name: Ceramic; Manufacture: Murata; Part Number: GRM21BR71H105K; id: cap151; TKE: X7R
C7 = cap259: Конденсатор полярный; Part Name: Tantal; Manufacture: AVX; Part Number: TAJD336K035RNJ; id: cap259
DA2 = pwr48: 4-Bit Bidirectional Voltage-level Translator; Part Name: 4 4-Bit Bidirectional Voltage-level Translator; Manufacturer: Texas Instruments; id: pwr48; Input Voltage: 1,2-3,6B; Output Voltage: 1,65-5,5B; Current: 50mA; Type: Isolated
DA4 = driver23: High and Low Side Driver; Manufacture: International Rectifier; Logic High: 3-20B; Logic Low: 1,5-8B; Min Operating Supply Voltage: 10B; Max Operating Supply Voltage: 20B; Maximum output current: 2,5A; id: driver23; Part Name: High and Low side Driver
R4 R21 = res41: Резистор; Manufacture: Yageo; Part Number: RC0805FR-0747RL; id: res41; Accuracy: 0.01; Part Name: Resistor; Power: 0,125Вт
R5 = res739: Резистор; Manufacture: Yageo; Part Number: RC1206FR-074M3; id: res739; Accuracy: 0.01; Power: 0,25Вт; Part Name: Resistor
R6 R24 = res73: as R19 on sheet PainRegister_PWM; Part Name: Resistor; Power: 0,125Вт
R7 = res25: as R26 on sheet PainRegister_PWM; Part Name: Resistor; Power: 0,125Вт
R8 R11 R25 = res113: Резистор; Manufacture: Yageo; Part Number: RC0805FR-0747KL; id: res113; Accuracy: 0.01; Part Name: Resistor; Power: 0,125Вт
VD1 VD8 = diode21: Диод; Part Number: SMA4007; Manufacture: Wing Shing; Max Reverse Voltage: 1000B; Forward Voltage: 1,1B; Forward Current: 1A; Reverse Recovery time: 18ns; Capacitance: 12pF; Number of Channels: 1; id: diode21; Part Name: Diode
VD6 = diode1: Диод Шоттки; Part Number: SK34A; Manufacture: Taiwan Semiconductor; id: diode1; Max Reverse Voltage: 40B; Forward Voltage: 0,55B; Forward Current: 3A; Part Name: Diode Schottky
VT2 VT4 = trans10: as VT3 on sheet PainRegister_PWM; id: trans10
X2 = connect7: Разъем - 2 конт. розетка; Part Name: CWF-2R type A; Part Number: DS1069-2 MR-A; Manufacture: Ningbo connfly electronic; Contact_1: Прямой; Contact_2: Ответный; Etch: 2,5mm; id: connect7

## Sheet PainRegister_Amplifier.SchDoc
size 420 x 297 mm; DocumentNumber: СКТБ.411126.001 Э3; SheetNumber: 5; Format: A3
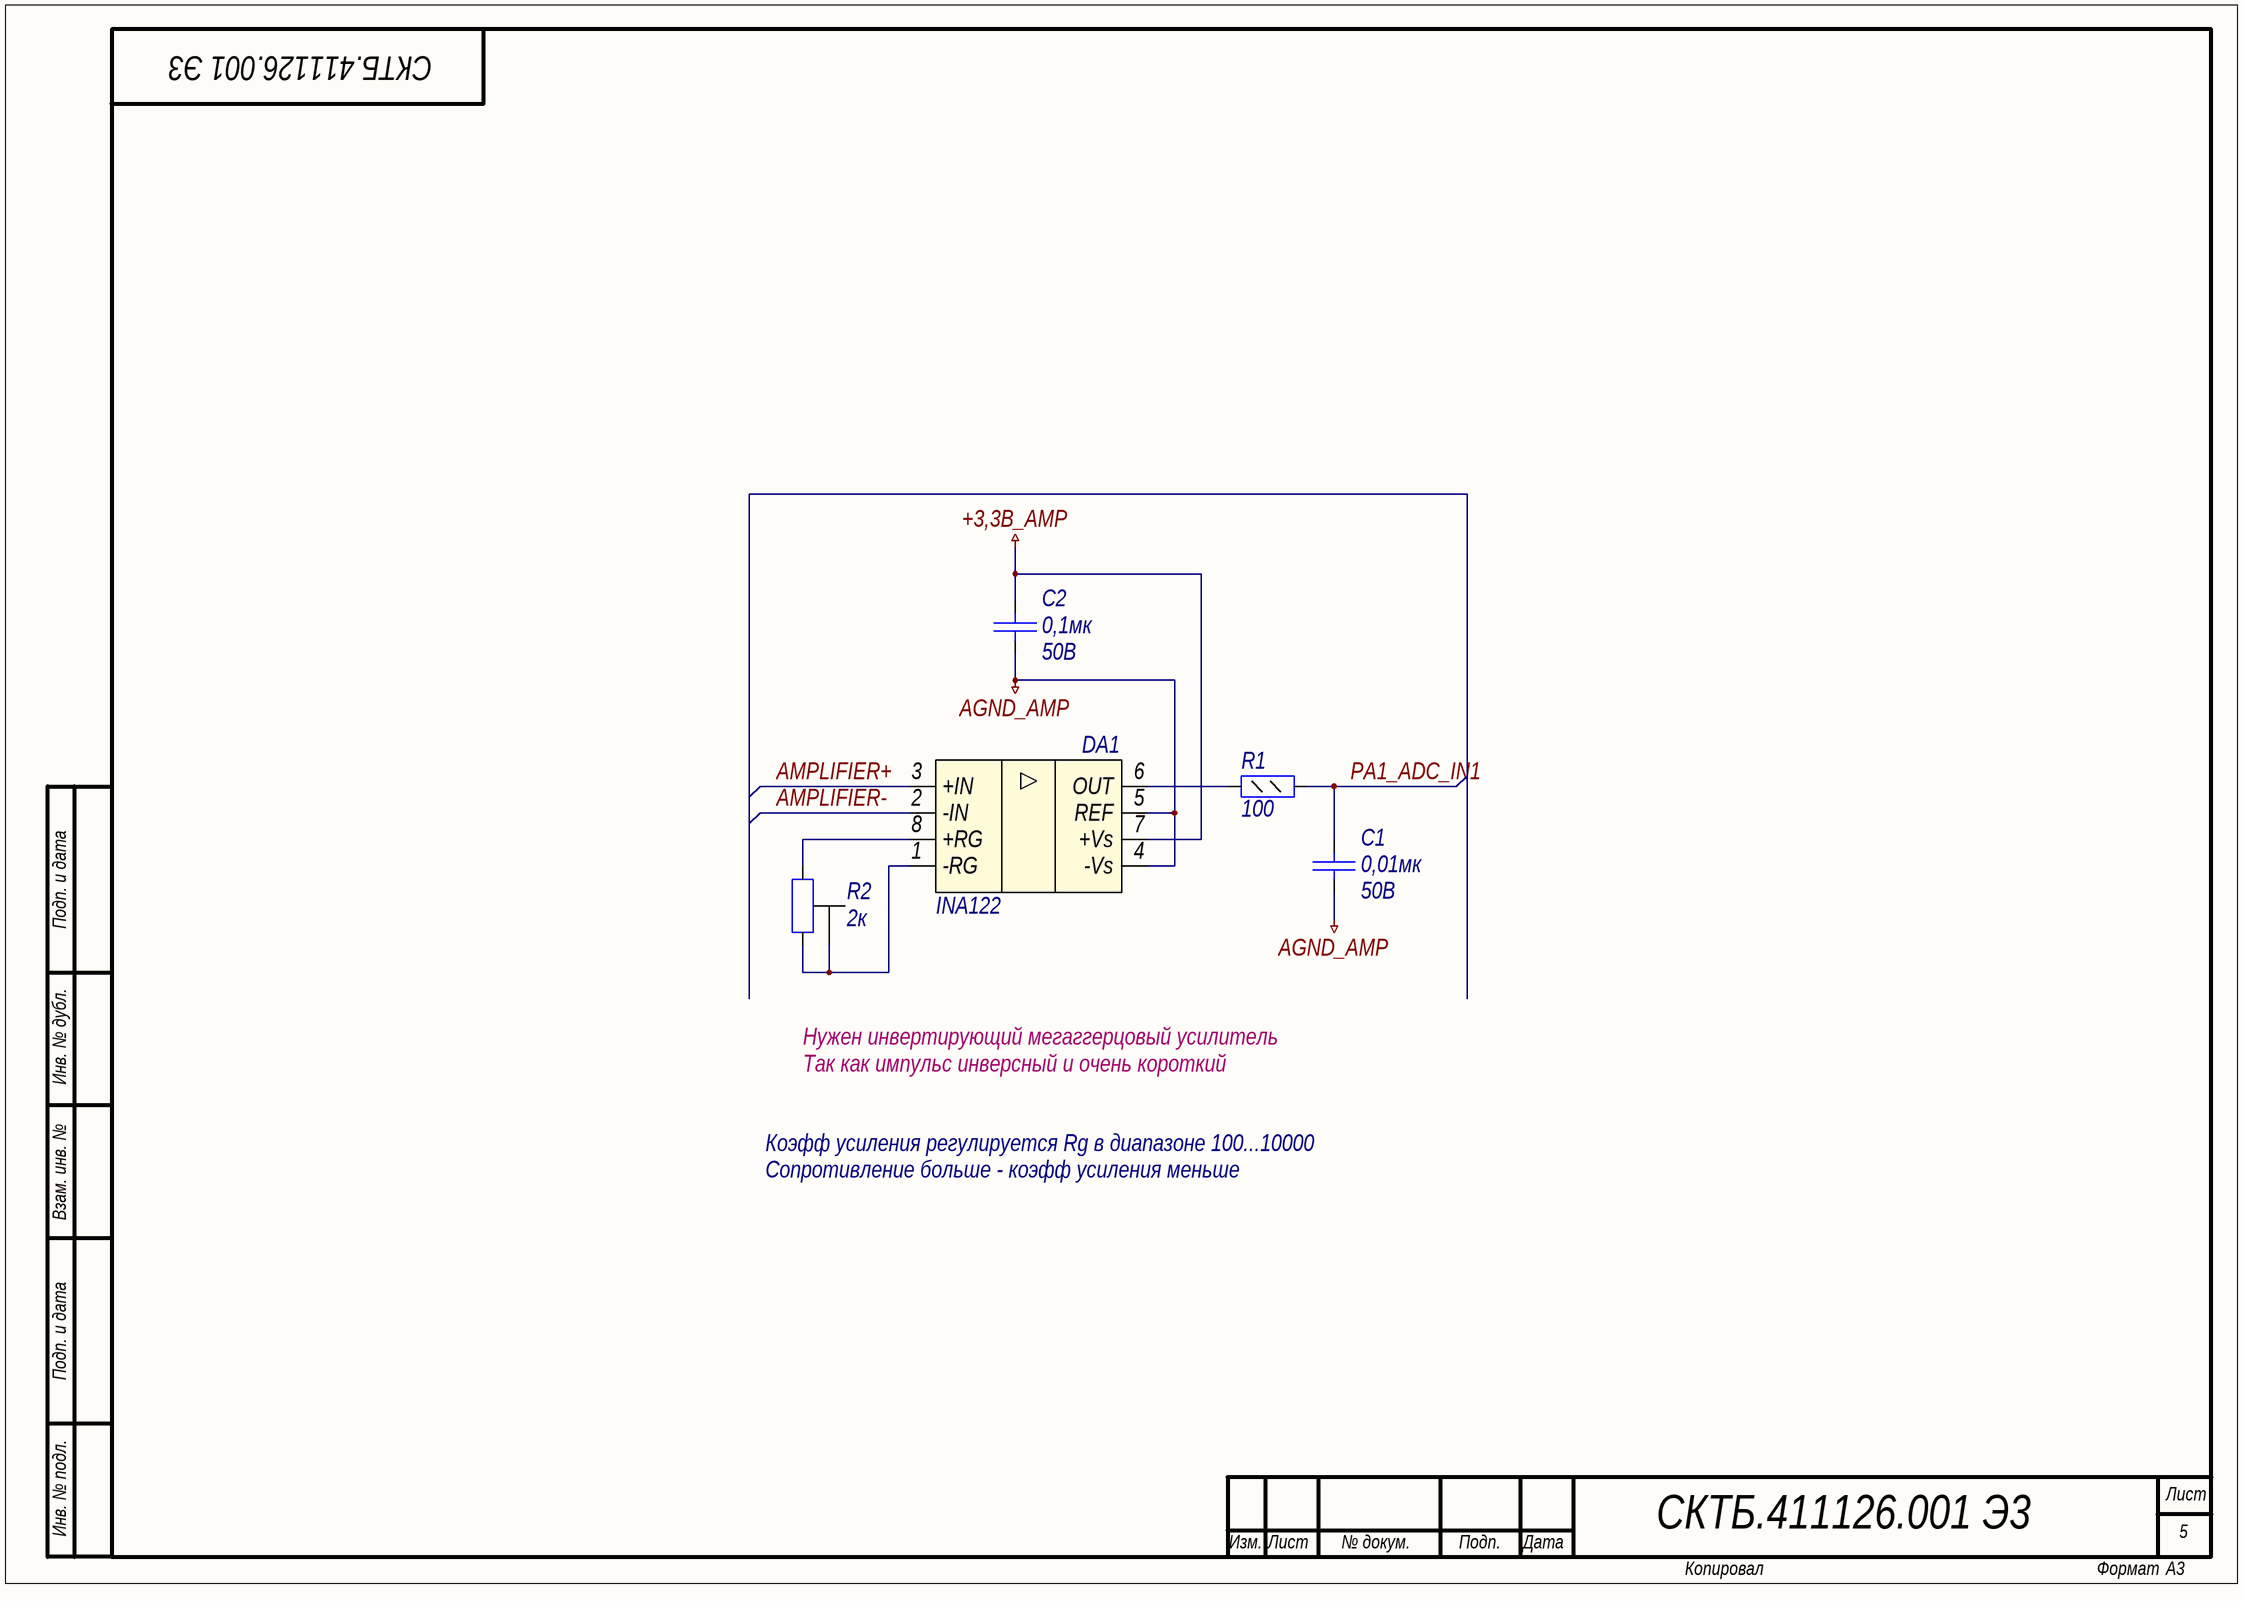
[diagram p4: PainRegister_Amplifier.SchDoc]

### Parts
C1  value 0,01мк  Voltage: 50B  [C0805]  (hidden comment: Capacitor)
C2  value 0,1мк  Voltage: 50В  [C0805]  (hidden comment: Capacitor)
DA1  INA122  [SO8]
R1  value 100  [R0805]  (hidden comment: Resistor_0,125Вт)
R2  value 2к  [3296Y]  (hidden comment: Potentiometer)

### Nets
+3,3В_AMP: C2.2 DA1.7(+Vs)
AGND_AMP: C1.1 C2.1 DA1.4(-Vs) DA1.5(REF)
AMPLIFIER-: DA1.2(-IN)
AMPLIFIER+: DA1.3(+IN)
PA1_ADC_IN1: C1.2 R1.2
NetDA1_1: DA1.1(-RG) R2.2 R2.3
NetDA1_6: DA1.6(OUT) R1.1
NetDA1_8: DA1.8(+RG) R2.1

### Notes on the sheet
- Подп. и дата
- Инв. № дубл.
- Нужен инвертирующий мегаггерцовый усилитель
- Так как импульс инверсный и очень короткий
- Взам. инв. №
- Коэфф усиления регулируется Rg в диапазоне 100...10000
- Сопротивление больше - коэфф усиления меньше
- Инв. № подл.
- Лист
- Изм.
- № докум.
- Подп.
- Дата
- Копировал
- Формат

### Library data of the parts
C1 = cap136: Конденсатор; Part Name: Ceramic; Manufacture: Murata; Part Number: GRM216R71H103K; id: cap136; TKE: X7R
C2 = cap160: as C19 on sheet PainRegister_Power
DA1 = amp14: Low Cost Low Power  Instrumentation Amplifier; Part Number: INA122PU; Manufacture: Texas Instruments; id: amp14; Rail-to-rail: yes; Supply Voltage: 2,2В–36В or -0,9/+1,3В to (+-)18B; Supply Current max: 85uA; Bandwidth: g=5 120kHz, g=100 5kHz, g=500 0,9kHz; Input Bias Current: 50nA; CMRR: 90dB; Offset voltage: 0,5mB; Channels: 1; Part Name: Instrumentation Amplifier
R1 = res49: Резистор; Manufacture: Yageo; Part Number: RC0805FR-07100RL; id: res49; Accuracy: 0.01; Part Name: Resistor; Power: 0,125Вт
R2 = res986: Part Name: Resistor; Manufacture: Bourns; Part Number: 3296Y-1-202LF; id: res986; Accuracy: 0.1; Power: 0,5Вт

## Nets that join several sheets
+3,3В: PainRegister_MCU (11 pins), PainRegister_Power (C22.1 DA3.4 L2.2 L5.1), PainRegister_Bridge (C5.2 C6.2 DA2.1 DA2.8)
+3,3В_AMP: PainRegister_Power (C25.1 L5.2), PainRegister_Amplifier (C2.2 DA1.7)
+5B_CP2102: PainRegister_MCU (VD2.2), PainRegister_Power (C8.1 L9.2)
+5B_D: PainRegister_Power (C24.1 L3.2), PainRegister_Bridge (6 pins)
+12В_D: PainRegister_Power (C26.1 L6.2), PainRegister_Bridge (C9.2 DA4.3 VD6.2)
+12В_PWM: PainRegister_Power (C36.1 L8.2), PainRegister_PWM (5 pins)
AGND_AMP: PainRegister_Power (R15.2), PainRegister_Amplifier (C1.1 C2.1 DA1.4 DA1.5)
AMPLIFIER-: PainRegister_Power (22 pins), PainRegister_PWM (10 pins), PainRegister_Bridge (8 pins), PainRegister_Amplifier (DA1.2)
DGND: PainRegister_MCU (16 pins), PainRegister_Power (R14.2), PainRegister_Bridge (10 pins)
AMPLIFIER+: PainRegister_Bridge (R7.2 X2.2), PainRegister_Amplifier (DA1.3)
DRIVER_HIN: PainRegister_MCU (DD1.32), PainRegister_Bridge (DA2.2 R11.2)
DRIVER_LIN: PainRegister_MCU (DD1.29), PainRegister_Bridge (DA2.5 R25.2)
DRIVER_SD: PainRegister_MCU (DD1.31), PainRegister_Bridge (DA2.3 R8.2)
HIGH_VOLTAGE: PainRegister_PWM (C30.1 R12.2 VD3.1), PainRegister_Bridge (R5.2)
PA1_ADC_IN1: PainRegister_MCU (DD1.18), PainRegister_Amplifier (C1.2 R1.2)